# EAGLE schematic midi2cv.2.2.pnl (EAGLE 7.5.0)
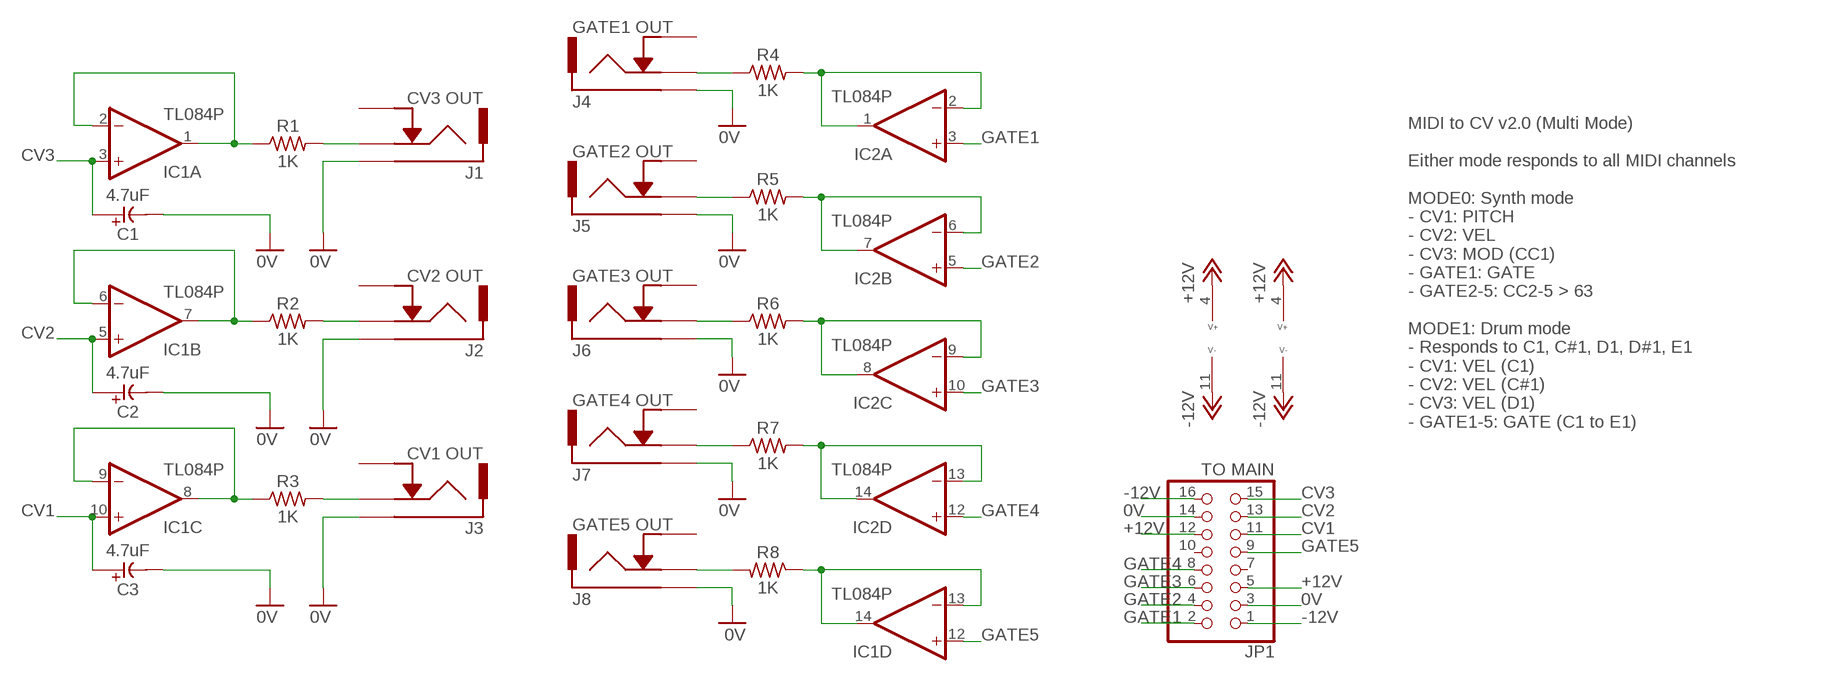
[diagram p0: schematic, sheet 1]

## Parts
C1  4.7uF  CE-USE2-5  [E2-5]
C2  4.7uF  CE-USE2-5  [E2-5]
C3  4.7uF  CE-USE2-5  [E2-5]
IC1  TL084P  [DIL14]
IC2  TL084P  [DIL14]
J1  CV3 OUT  ACJM-MV35-2S  [ACJM-MV35-2S]
J2  CV2 OUT  ACJM-MV35-2S  [ACJM-MV35-2S]
J3  CV1 OUT  ACJM-MV35-2S  [ACJM-MV35-2S]
J4  GATE1 OUT  ACJM-MV35-2S  [ACJM-MV35-2S]
J5  GATE2 OUT  ACJM-MV35-2S  [ACJM-MV35-2S]
J6  GATE3 OUT  ACJM-MV35-2S  [ACJM-MV35-2S]
J7  GATE4 OUT  ACJM-MV35-2S  [ACJM-MV35-2S]
J8  GATE5 OUT  ACJM-MV35-2S  [ACJM-MV35-2S]
JP1  TO MAIN  PINHD-2X8  [2X08]
R1  1K  R0309/10  [0309/10]
R2  1K  R0309/10  [0309/10]
R3  1K  R0309/10  [0309/10]
R4  1K  R0309/10  [0309/10]
R5  1K  R0309/10  [0309/10]
R6  1K  R0309/10  [0309/10]
R7  1K  R0309/10  [0309/10]
R8  1K  R0309/10  [0309/10]

## Nets
0V: C1.- C2.- C3.- J1.P$1 J2.P$1 J3.P$1 J4.P$1 J5.P$1 J6.P$1 J7.P$1 J8.P$1 JP1.3 JP1.14
+12V: IC1.4(P:V+) IC2.4(P:V+) JP1.5 JP1.12
-12V: IC1.11(P:V-) IC2.11(P:V-) JP1.1 JP1.16
CV1: C3.+ IC1.10(C:+IN) JP1.11
CV2: C2.+ IC1.5(B:+IN) JP1.13
CV3: C1.+ IC1.3(A:+IN) JP1.15
GATE1: IC2.3(A:+IN) JP1.2
GATE2: IC2.5(B:+IN) JP1.4
GATE3: IC2.10(C:+IN) JP1.6
GATE4: IC2.12(D:+IN) JP1.8
GATE5: IC1.12(D:+IN) JP1.9
N$2: IC1.1(A:OUT) IC1.2(A:-IN) R1.1
N$3: IC1.6(B:-IN) IC1.7(B:OUT) R2.1
N$4: IC1.8(C:OUT) IC1.9(C:-IN) R3.1
N$7: IC1.13(D:-IN) IC1.14(D:OUT) R8.1
N$21: J4.P$3 R4.1
N$22: J5.P$3 R5.1
N$23: J6.P$3 R6.1
N$24: J7.P$3 R7.1
N$25: J8.P$3 R8.2
N$31: IC2.13(D:-IN) IC2.14(D:OUT) R7.2
N$35: IC2.8(C:OUT) IC2.9(C:-IN) R6.2
N$36: IC2.6(B:-IN) IC2.7(B:OUT) R5.2
N$37: IC2.1(A:OUT) IC2.2(A:-IN) R4.2
N$44: J1.P$3 R1.2
N$45: J2.P$3 R2.2
N$46: J3.P$3 R3.2
Unconnected: J1.P$2 J2.P$2 J3.P$2 J4.P$2 J5.P$2 J6.P$2 J7.P$2 J8.P$2 JP1.7 JP1.10

## Notes on the sheet
- MIDI to CV v2.0 (Multi Mode)
  
  Either mode responds to all MIDI channels
  
  MODE0: Synth mode 
  - CV1: PITCH
  - CV2: VEL
  - CV3: MOD (CC1)
  - GATE1: GATE
  - GATE2-5: CC2-5 > 63
  
  MODE1: Drum mode
  - Responds to C1, C#1, D1, D#1, E1
  - CV1: VEL (C1)
  - CV2: VEL (C#1)
  - CV3: VEL (D1)
  - GATE1-5: GATE (C1 to E1)

## Library data of the parts
C1-C3 = _common:CE-US: ELECTROLYTIC CAPACITOR, US symbol
IC1 IC2 = _common:TL084: OP AMP
J1-J8 = jacks:ACJM-MV35-2S: Amphenol 3.5mm Jack (Vertical) ACJM-MV35-2S http://ca.mouser.com/Search/ProductDetail.aspx?R=ACJM-MV35-2Svirtualkey52380000virtualkey523-ACJMMV352S
JP1 = pinhead:PINHD-2X8: PIN HEADER
R1-R8 = _common:R: RESISTOR, US symbol